# Altium project Dashboard Board.PrjPCB
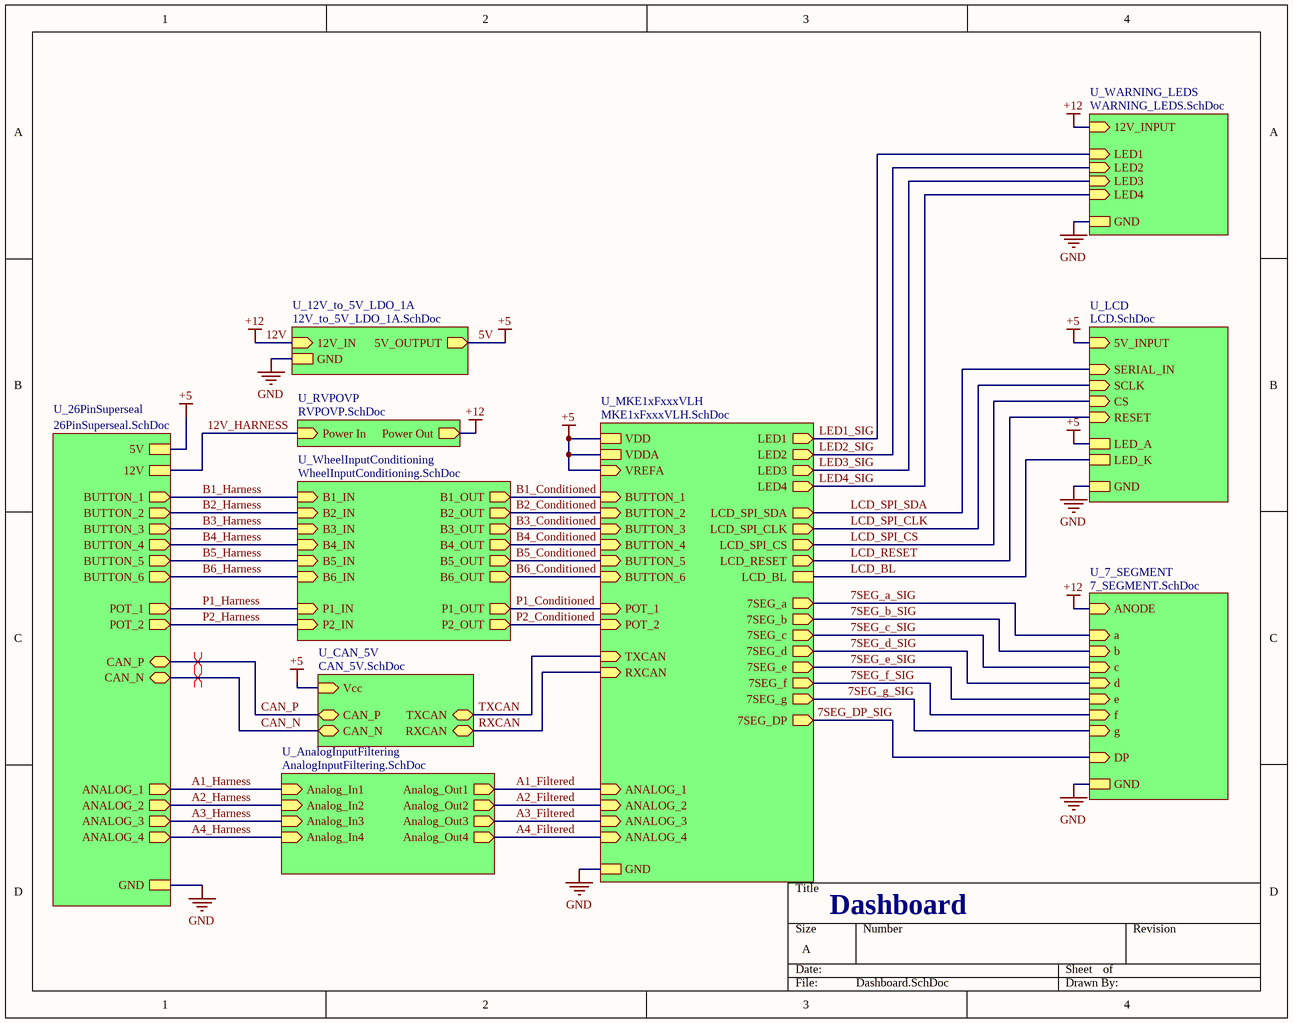
[diagram p0: Dashboard.SchDoc]
15 sheets, 126 parts. Net scope: hierarchical (ports join the sheet entries above them; power ports are global).
Board files: DashboardBoard.PcbDoc, DashboardBoardREV2.PcbDoc
Sheets:
  Dashboard.SchDoc
    U_CAN_5V = CAN_5V.SchDoc
    U_7_SEGMENT = 7_SEGMENT.SchDoc
      U_LED_Driver = LED_Driver.SchDoc
      U_LED_Driver = LED_Driver.SchDoc
      U_LED_Driver = LED_Driver.SchDoc
      U_LED_Driver = LED_Driver.SchDoc
      U_LED_Driver = LED_Driver.SchDoc
      U_LED_Driver = LED_Driver.SchDoc
      U_LED_Driver = LED_Driver.SchDoc
      U_LED_Driver = LED_Driver.SchDoc
    U_RVPOVP = RVPOVP.SchDoc
    U_WARNING_LEDS = WARNING_LEDS.SchDoc
      U_LED_Driver = LED_Driver.SchDoc
      U_LED_Driver = LED_Driver.SchDoc
      U_LED_Driver = LED_Driver.SchDoc
      U_LED_Driver = LED_Driver.SchDoc
    U_MKE1xFxxxVLH = MKE1xFxxxVLH.SchDoc
      U_FTDI_USB_UART = FTDI_USB_UART.SchDoc
    U_LCD = LCD.SchDoc
      U_LED_Driver = LED_Driver.SchDoc
    U_WheelInputConditioning = WheelInputConditioning.SchDoc
      U_ButtonBuffering = ButtonBuffering.SchDoc
      U_ButtonBuffering = ButtonBuffering.SchDoc
      U_ButtonBuffering = ButtonBuffering.SchDoc
    U_26PinSuperseal = 26PinSuperseal.SchDoc
    U_12V_to_5V_LDO_1A = 12V_to_5V_LDO_1A.SchDoc
    U_AnalogInputFiltering = AnalogInputFiltering.SchDoc
      U_PassiveFilter = PassiveFilter.SchDoc
      U_PassiveFilter = PassiveFilter.SchDoc
      U_PassiveFilter = PassiveFilter.SchDoc
      U_PassiveFilter = PassiveFilter.SchDoc

## Sheet Dashboard.SchDoc
size A; DocumentNumber: 10; SheetNumber: 10; SheetTotal: 12

### Sub-sheets
U_7_SEGMENT = 7_SEGMENT.SchDoc: GND, DP (in), ANODE (in), g (in), e (in), f (in), b (in), a (in), d (in), c (in)
U_12V_to_5V_LDO_1A = 12V_to_5V_LDO_1A.SchDoc: 12V_IN (in), GND, 5V_OUTPUT (out)
U_26PinSuperseal = 26PinSuperseal.SchDoc: GND, CAN_P (bidir), 12V, POT_2 (out), BUTTON_1 (out), BUTTON_2 (out), BUTTON_3 (out), POT_1 (out), BUTTON_4 (out), CAN_N (bidir), 5V, BUTTON_6 (out), BUTTON_5 (out), ANALOG_3 (out), ANALOG_1 (out), ANALOG_2 (out), ANALOG_4 (out)
U_AnalogInputFiltering = AnalogInputFiltering.SchDoc: Analog_In1 (in), Analog_In2 (in), Analog_In3 (in), Analog_In4 (in), Analog_Out1 (out), Analog_Out2 (out), Analog_Out3 (out), Analog_Out4 (out)
U_CAN_5V = CAN_5V.SchDoc: Vcc (in), CAN_N (bidir), CAN_P (bidir), TXCAN (bidir), RXCAN (bidir)
U_LCD = LCD.SchDoc: 5V_INPUT (in), GND, LED_A, LED_K, SCLK (in), CS (in), RESET (in), SERIAL_IN (in)
U_MKE1xFxxxVLH = MKE1xFxxxVLH.SchDoc: VDD, VDDA, VREFA (in), GND, POT_1 (in), BUTTON_4 (in), RXCAN (in), BUTTON_1 (in), BUTTON_2 (in), LED1 (out), TXCAN (in), LED4 (out), LED3 (out), LED2 (out), BUTTON_3 (in), POT_2 (in), LCD_RESET (out), LCD_SPI_CS (out), LCD_SPI_CLK (out), LCD_SPI_SDA (out), 7SEG_a (out), 7SEG_DP (out), 7SEG_e (out), 7SEG_f (out), 7SEG_d (out), 7SEG_g (out), 7SEG_c (out), 7SEG_b (out), LCD_BL, BUTTON_5 (in), BUTTON_6 (in), ANALOG_3 (in), ANALOG_1 (in), ANALOG_2 (in), ANALOG_4 (in)
U_RVPOVP = RVPOVP.SchDoc: Power Out (out), Power In (in)
U_WARNING_LEDS = WARNING_LEDS.SchDoc: GND, 12V_INPUT (in), LED1 (in), LED2 (in), LED3 (in), LED4 (in)
U_WheelInputConditioning = WheelInputConditioning.SchDoc: B1_IN (in), B2_IN (in), B3_IN (in), B4_IN (in), P1_IN (in), P2_IN (in), P2_OUT (out), P1_OUT (out), B4_OUT (out), B3_OUT (out), B2_OUT (out), B1_OUT (out), B6_IN (in), B5_OUT (out), B5_IN (in), B6_OUT (out)

### Nets
5V: sheet U_CAN_5V/Vcc, sheet U_MKE1xFxxxVLH/VDD, sheet U_MKE1xFxxxVLH/VDDA, sheet U_MKE1xFxxxVLH/VREFA, sheet U_LCD/5V_INPUT, sheet U_LCD/LED_A, sheet U_26PinSuperseal/5V, sheet U_12V_to_5V_LDO_1A/5V_OUTPUT  [also labelled +5]
12V: sheet U_7_SEGMENT/ANODE, sheet U_RVPOVP/Power Out, sheet U_WARNING_LEDS/12V_INPUT, sheet U_12V_to_5V_LDO_1A/12V_IN  [also labelled +12]
GND: sheet U_7_SEGMENT/GND, sheet U_WARNING_LEDS/GND, sheet U_MKE1xFxxxVLH/GND, sheet U_LCD/GND, sheet U_26PinSuperseal/GND, sheet U_12V_to_5V_LDO_1A/GND
7SEG_a_SIG: sheet U_7_SEGMENT/a, sheet U_MKE1xFxxxVLH/7SEG_a
7SEG_b_SIG: sheet U_7_SEGMENT/b, sheet U_MKE1xFxxxVLH/7SEG_b
7SEG_c_SIG: sheet U_7_SEGMENT/c, sheet U_MKE1xFxxxVLH/7SEG_c
7SEG_d_SIG: sheet U_7_SEGMENT/d, sheet U_MKE1xFxxxVLH/7SEG_d
7SEG_DP_SIG: sheet U_7_SEGMENT/DP, sheet U_MKE1xFxxxVLH/7SEG_DP
7SEG_e_SIG: sheet U_7_SEGMENT/e, sheet U_MKE1xFxxxVLH/7SEG_e
7SEG_f_SIG: sheet U_7_SEGMENT/f, sheet U_MKE1xFxxxVLH/7SEG_f
7SEG_g_SIG: sheet U_7_SEGMENT/g, sheet U_MKE1xFxxxVLH/7SEG_g
12V_HARNESS: sheet U_RVPOVP/Power In, sheet U_26PinSuperseal/12V
A1_Filtered: sheet U_MKE1xFxxxVLH/ANALOG_1, sheet U_AnalogInputFiltering/Analog_Out1
A1_Harness: sheet U_26PinSuperseal/ANALOG_1, sheet U_AnalogInputFiltering/Analog_In1
A2_Filtered: sheet U_MKE1xFxxxVLH/ANALOG_2, sheet U_AnalogInputFiltering/Analog_Out2
A2_Harness: sheet U_26PinSuperseal/ANALOG_2, sheet U_AnalogInputFiltering/Analog_In2
A3_Filtered: sheet U_MKE1xFxxxVLH/ANALOG_3, sheet U_AnalogInputFiltering/Analog_Out3
A3_Harness: sheet U_26PinSuperseal/ANALOG_3, sheet U_AnalogInputFiltering/Analog_In3
A4_Filtered: sheet U_MKE1xFxxxVLH/ANALOG_4, sheet U_AnalogInputFiltering/Analog_Out4
A4_Harness: sheet U_26PinSuperseal/ANALOG_4, sheet U_AnalogInputFiltering/Analog_In4
B1_Conditioned: sheet U_MKE1xFxxxVLH/BUTTON_1, sheet U_WheelInputConditioning/B1_OUT
B1_Harness: sheet U_WheelInputConditioning/B1_IN, sheet U_26PinSuperseal/BUTTON_1
B2_Conditioned: sheet U_MKE1xFxxxVLH/BUTTON_2, sheet U_WheelInputConditioning/B2_OUT
B2_Harness: sheet U_WheelInputConditioning/B2_IN, sheet U_26PinSuperseal/BUTTON_2
B3_Conditioned: sheet U_MKE1xFxxxVLH/BUTTON_3, sheet U_WheelInputConditioning/B3_OUT
B3_Harness: sheet U_WheelInputConditioning/B3_IN, sheet U_26PinSuperseal/BUTTON_3
B4_Conditioned: sheet U_MKE1xFxxxVLH/BUTTON_4, sheet U_WheelInputConditioning/B4_OUT
B4_Harness: sheet U_WheelInputConditioning/B4_IN, sheet U_26PinSuperseal/BUTTON_4
B5_Conditioned: sheet U_MKE1xFxxxVLH/BUTTON_5, sheet U_WheelInputConditioning/B5_OUT
B5_Harness: sheet U_WheelInputConditioning/B5_IN, sheet U_26PinSuperseal/BUTTON_5
B6_Conditioned: sheet U_MKE1xFxxxVLH/BUTTON_6, sheet U_WheelInputConditioning/B6_OUT
B6_Harness: sheet U_WheelInputConditioning/B6_IN, sheet U_26PinSuperseal/BUTTON_6
CAN_N: sheet U_CAN_5V/CAN_N, sheet U_26PinSuperseal/CAN_N
CAN_P: sheet U_CAN_5V/CAN_P, sheet U_26PinSuperseal/CAN_P
LCD_BL: sheet U_MKE1xFxxxVLH/LCD_BL, sheet U_LCD/LED_K
LCD_RESET: sheet U_MKE1xFxxxVLH/LCD_RESET, sheet U_LCD/RESET
LCD_SPI_CLK: sheet U_MKE1xFxxxVLH/LCD_SPI_CLK, sheet U_LCD/SCLK
LCD_SPI_CS: sheet U_MKE1xFxxxVLH/LCD_SPI_CS, sheet U_LCD/CS
LCD_SPI_SDA: sheet U_MKE1xFxxxVLH/LCD_SPI_SDA, sheet U_LCD/SERIAL_IN
LED1_SIG: sheet U_WARNING_LEDS/LED1, sheet U_MKE1xFxxxVLH/LED1  [project net LED1]
LED2_SIG: sheet U_WARNING_LEDS/LED2, sheet U_MKE1xFxxxVLH/LED2  [project net LED2]
LED3_SIG: sheet U_WARNING_LEDS/LED3, sheet U_MKE1xFxxxVLH/LED3  [project net LED3]
LED4_SIG: sheet U_WARNING_LEDS/LED4, sheet U_MKE1xFxxxVLH/LED4  [project net LED4]
P1_Conditioned: sheet U_MKE1xFxxxVLH/POT_1, sheet U_WheelInputConditioning/P1_OUT
P1_Harness: sheet U_WheelInputConditioning/P1_IN, sheet U_26PinSuperseal/POT_1
P2_Conditioned: sheet U_MKE1xFxxxVLH/POT_2, sheet U_WheelInputConditioning/P2_OUT
P2_Harness: sheet U_WheelInputConditioning/P2_IN, sheet U_26PinSuperseal/POT_2
RXCAN: sheet U_CAN_5V/RXCAN, sheet U_MKE1xFxxxVLH/RXCAN
TXCAN: sheet U_CAN_5V/TXCAN, sheet U_MKE1xFxxxVLH/TXCAN

### Layout directives
differential pair: CAN_N, CAN_P

### Notes on the sheet
- Dashboard

## Sheet CAN_5V.SchDoc
size A; DocumentNumber: 5; SheetNumber: 5; SheetTotal: 12
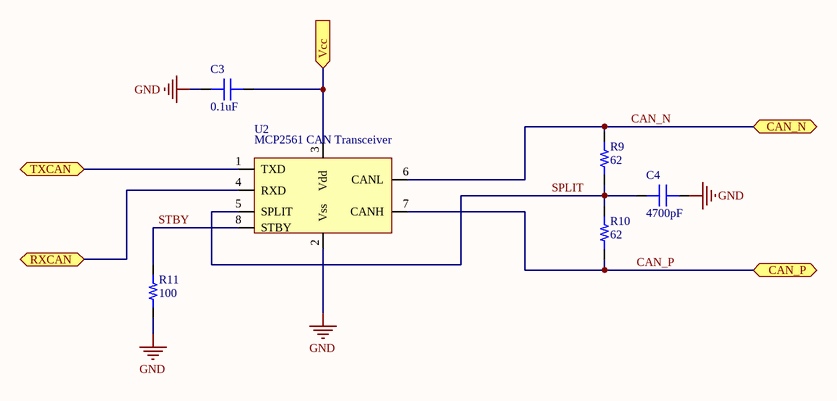
[diagram p1: CAN_5V.SchDoc]

### Parts
(Parts that share a designator on the sheet are numbered #1, #2 ... from top to bottom, then left to right.)
C3#1  capacitance: 0.1uF  [0603]  (hidden comment: capacitor)
C4#1  capacitance: 4700pF  [0603]  (hidden comment: capacitor)
R9  62  [RES 0603/1608]
R10  62  [RES 0603/1608]
R11  100  [RES 0603/1608]
U2  MCP2561 CAN Transceiver  [SOIC-8]

### Ports
CAN_N (bidir), CAN_P (bidir), RXCAN (bidir), TXCAN (bidir), Vcc (in)

### Nets
5V: C3#1.2 U2.3(Vdd) ; port Vcc
GND: C3#1.1 C4#1.2 R11.1 U2.2(Vss)
CAN_N: R9.2 U2.6(CANL) ; port CAN_N
CAN_P: R10.1 U2.7(CANH) ; port CAN_P
RXCAN: U2.4(RXD) ; port RXCAN
SPLIT: C4#1.1 R9.1 R10.2 U2.5(SPLIT)
STBY: R11.2 U2.8(STBY)
TXCAN: U2.1(TXD) ; port TXCAN

### Library data of the parts
C3#1 C4#1 = 1: Generic 0603 capacitor; id: 1; voltage: 50; dielectric: Ceramic; percent tolerance: 10; name: 0603 Capacitor; ESR: 1; package: 0603; quantity: 0
R9-R11 = 1: id: 1; name: 0603 Resistor; percent tolerance: 5; package: 0603; quantity: 0
  R9 R10: resistance: 62
  R11: resistance: 100
U2 = 5: id: 5; name: null; vcc: 0; type: CAN; package: SOIC-8; quantity: 0; link: https://www.digikey.com/product-detail/en/microchip-technology/MCP2561T-E-SN/MCP2561T-E-SNCT-ND/5148846

## Sheet 7_SEGMENT.SchDoc
size A; DocumentNumber: 6; SheetNumber: 6; SheetTotal: 12
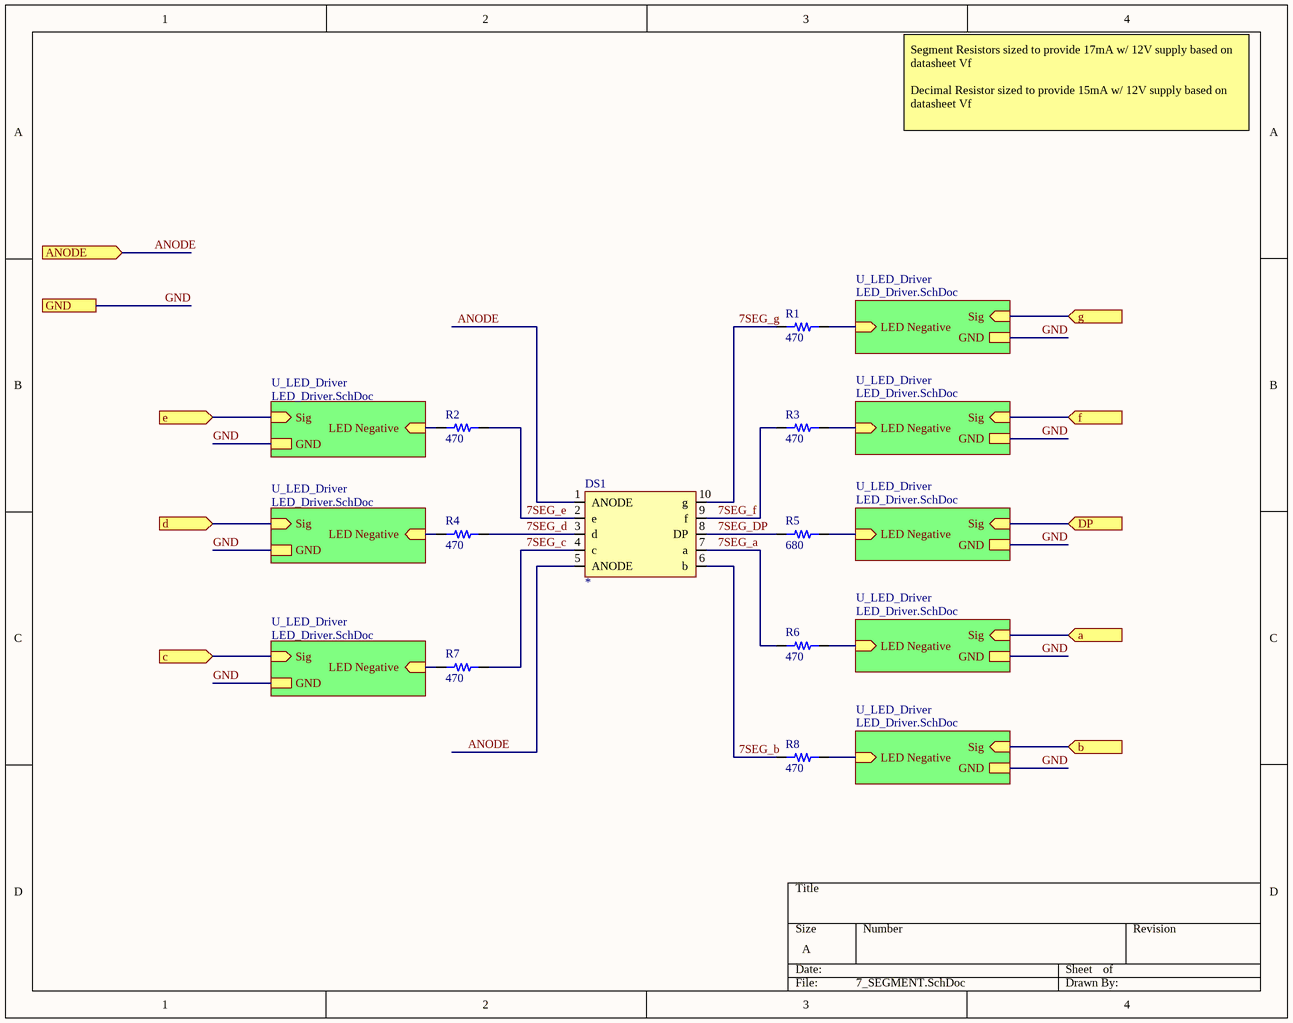
[diagram p2: 7_SEGMENT.SchDoc]

### Parts
(Parts that share a designator on the sheet are numbered #1, #2 ... from top to bottom, then left to right.)
DS1  *  [SA15-11EWA]
R1#1  470  [RES 0805/2012]
R2#1  470  [RES 0805/2012]
R3#1  470  [RES 0805/2012]
R4#1  470  [RES 0805/2012]
R5#1  680  [RES 0805/2012]
R6#1  470  [RES 0805/2012]
R7#1  470  [RES 0805/2012]
R8#1  470  [RES 0805/2012]

### Sub-sheets
U_LED_Driver = LED_Driver.SchDoc: LED Negative (in), Sig (in), GND
U_LED_Driver = LED_Driver.SchDoc: LED Negative (in), Sig (in), GND
U_LED_Driver = LED_Driver.SchDoc: LED Negative (in), Sig (in), GND
U_LED_Driver = LED_Driver.SchDoc: LED Negative (in), Sig (in), GND
U_LED_Driver = LED_Driver.SchDoc: LED Negative (in), Sig (in), GND
U_LED_Driver = LED_Driver.SchDoc: LED Negative (in), Sig (in), GND
U_LED_Driver = LED_Driver.SchDoc: LED Negative (in), Sig (in), GND
U_LED_Driver = LED_Driver.SchDoc: LED Negative (in), Sig (in), GND

### Ports
a (in), ANODE (in), b (in), c (in), d (in), DP (in), e (in), f (in), g (in), GND

### Nets
ANODE: DS1.1(ANODE) DS1.5(ANODE) ; port ANODE  [project net 12V]
GND: port GND, sheet U_LED_Driver/GND, sheet U_LED_Driver/GND, sheet U_LED_Driver/GND, sheet U_LED_Driver/GND, sheet U_LED_Driver/GND, sheet U_LED_Driver/GND, sheet U_LED_Driver/GND, sheet U_LED_Driver/GND
7SEG_a: DS1.7(a) R6#1.1
7SEG_a_SIG: port a, sheet U_LED_Driver/Sig
7SEG_b: DS1.6(b) R8#1.1
7SEG_b_SIG: port b, sheet U_LED_Driver/Sig
7SEG_c: DS1.4(c) R7#1.2
7SEG_c_SIG: port c, sheet U_LED_Driver/Sig
7SEG_d: DS1.3(d) R4#1.2
7SEG_d_SIG: port d, sheet U_LED_Driver/Sig
7SEG_DP: DS1.8(DP) R5#1.1
7SEG_DP_SIG: port DP, sheet U_LED_Driver/Sig
7SEG_e: DS1.2(e) R2#1.2
7SEG_e_SIG: port e, sheet U_LED_Driver/Sig
7SEG_f: DS1.9(f) R3#1.1
7SEG_f_SIG: port f, sheet U_LED_Driver/Sig
7SEG_g: DS1.10(g) R1#1.1
7SEG_g_SIG: port g, sheet U_LED_Driver/Sig
LED_Negative: R1#1.2 ; sheet U_LED_Driver/LED Negative
LED_Negative: R5#1.2 ; sheet U_LED_Driver/LED Negative  [a separate net that carries the same name]
LED_Negative: R3#1.2 ; sheet U_LED_Driver/LED Negative  [a separate net that carries the same name]
LED_Negative: R6#1.2 ; sheet U_LED_Driver/LED Negative  [a separate net that carries the same name]
LED_Negative: R8#1.2 ; sheet U_LED_Driver/LED Negative  [a separate net that carries the same name]
LED_Negative: R7#1.1 ; sheet U_LED_Driver/LED Negative  [a separate net that carries the same name]
LED_Negative: R4#1.1 ; sheet U_LED_Driver/LED Negative  [a separate net that carries the same name]
LED_Negative: R2#1.1 ; sheet U_LED_Driver/LED Negative  [a separate net that carries the same name]

### Notes on the sheet
- Segment Resistors sized to provide 17mA w/ 12V supply based on datasheet Vf
  Decimal Resistor sized to provide 15mA w/ 12V supply based on datasheet Vf

### Library data of the parts
DS1 = 40: 7SEG DISPLAY 1DIGIT RED 1.5" CA; id: 40; vcc: 4; voltageinmax: 5; MfrPartNo: *; name: SA15-11EWA; quantity: 0; link: https://www.digikey.com/short/pdvmpz; createdby: Kevin
R1#1 R2#1 R3#1 R4#1 R5#1 R6#1 R7#1 R8#1 = 2: id: 2; name: 0805 Resistor; percent tolerance: 5; power: 1/4; package: 0805; quantity: 0; createdby: Kevin
  R1-R4 R6-R8: resistance: 470
  R5: resistance: 680

## Sheet LED_Driver.SchDoc
size A; DocumentNumber: 9; SheetNumber: 9; SheetTotal: 12
Used 13 times, as channels U_7_SEGMENT/U_LED_Driver, U_7_SEGMENT/U_LED_Driver, U_7_SEGMENT/U_LED_Driver, U_7_SEGMENT/U_LED_Driver, U_7_SEGMENT/U_LED_Driver, U_7_SEGMENT/U_LED_Driver, U_7_SEGMENT/U_LED_Driver, U_7_SEGMENT/U_LED_Driver, U_WARNING_LEDS/U_LED_Driver, U_WARNING_LEDS/U_LED_Driver, U_WARNING_LEDS/U_LED_Driver, U_WARNING_LEDS/U_LED_Driver, U_LCD/U_LED_Driver. Parts and nets are listed once, with the designators drawn on the sheet.
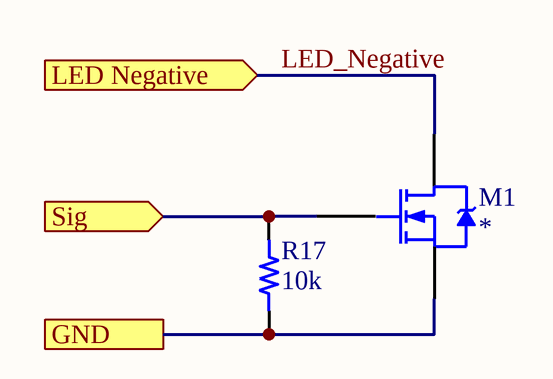
[diagram p3: LED_Driver.SchDoc]

### Parts
M1  *  [SOT23-3]
R17  10k  [RES 0603/1608]

### Ports
GND, LED Negative (in), Sig (in)

### Nets
GND: M1.2(S) R17.1 ; port GND
LED_Negative: M1.3(D) ; port LED Negative
Sig: M1.1(G) R17.2 ; port Sig

### Channels
U_7_SEGMENT/U_LED_Driver: designators M1=M7 R17=R43; ports GND=GND LED Negative=LED_Negative Sig=7SEG_g_SIG
U_7_SEGMENT/U_LED_Driver: designators M1=M6 R17=R42; ports GND=GND LED Negative=LED_Negative Sig=7SEG_f_SIG
U_7_SEGMENT/U_LED_Driver: designators M1=M5 R17=R41; ports GND=GND LED Negative=LED_Negative Sig=7SEG_DP_SIG
U_7_SEGMENT/U_LED_Driver: designators M1=M8 R17=R44; ports GND=GND LED Negative=LED_Negative Sig=7SEG_a_SIG
U_7_SEGMENT/U_LED_Driver: designators M1=M11 R17=R47; ports GND=GND LED Negative=LED_Negative Sig=7SEG_b_SIG
U_7_SEGMENT/U_LED_Driver: designators M1=M10 R17=R46; ports GND=GND LED Negative=LED_Negative Sig=7SEG_e_SIG
U_7_SEGMENT/U_LED_Driver: designators M1=M9 R17=R45; ports GND=GND LED Negative=LED_Negative Sig=7SEG_d_SIG
U_7_SEGMENT/U_LED_Driver: designators M1=M12 R17=R48; ports GND=GND LED Negative=LED_Negative Sig=7SEG_c_SIG
U_WARNING_LEDS/U_LED_Driver: designators M1=M3 R17=R16#1; ports GND=GND LED Negative=LED_Negative Sig=LED1
U_WARNING_LEDS/U_LED_Driver: designators M1=M4 R17=R15#1; ports GND=GND LED Negative=LED_Negative Sig=LED2
U_WARNING_LEDS/U_LED_Driver: designators M1=M1 R17=R13#1; ports GND=GND LED Negative=LED_Negative Sig=LED3
U_WARNING_LEDS/U_LED_Driver: designators M1=M2 R17=R14#1; ports GND=GND LED Negative=LED_Negative Sig=LED4
U_LCD/U_LED_Driver: designators M1=M13 R17=R50; ports GND=GND LED Negative=LED_Negative Sig=LCD_BL

### Library data of the parts
M1 = 6: MOSFET N-CHANNEL 30V 5A SOT23; id: 6; vdsmax: 0; numcircuits: 1; current: 2.8A; rdson: 90mOhm; vt: 800; MfrPartNo: *; name: DMG2302UK-7; type: N_Channel; vgsmax: 1; package: SOT-23; quantity: 0; link: https://www.digikey.com/product-detail/en/diodes-incorporated/DMG2302UK-7/DMG2302UK-7DICT-ND/6010163
R17 = 1: as R9 on sheet CAN_5V; resistance: 10k; package: 0603; quantity: 0

## Sheet RVPOVP.SchDoc
size A; DocumentNumber: 4; SheetNumber: 4; SheetTotal: 12
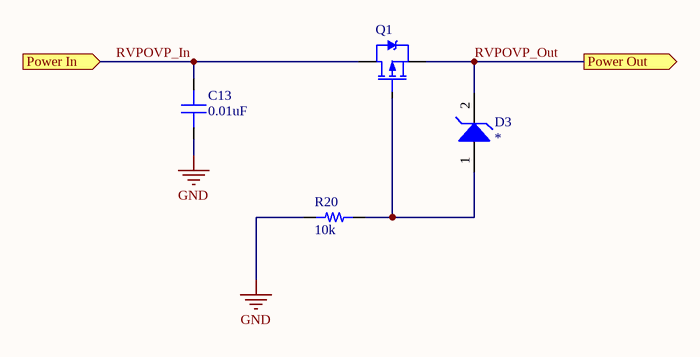
[diagram p4: RVPOVP.SchDoc]

### Parts
(Parts that share a designator on the sheet are numbered #1, #2 ... from top to bottom, then left to right.)
C13#1  capacitance: 0.01uF  [0603]  (hidden comment: capacitor)
D3  *  [SOD123F]
Q1  DMP3010LK3-13  [DMP3010LK3-13]  (value not drawn)
R20  10k  [RES 0603/1608]

### Ports
Power In (in), Power Out (out)

### Nets
GND: C13#1.1 R20.1
RVPOVP_Out: D3.2(K) Q1.2(S) ; port Power Out  [project net 12V]
RVPOVP_In: C13#1.2 Q1.3(D) ; port Power In  [project net 12V_HARNESS]
NetD3_1: D3.1(A) Q1.1(G) R20.2

### Library data of the parts
C13#1 = 1: as C3#1 on sheet CAN_5V; name: 0603 Capacitor; ESR: 1; package: 0603; quantity: 0
D3 = 10: Zener Diode 14V 500mW ±5% Surface Mount SOD-1; id: 10; name: DDZ9701; MfrPartNo: *; package: SOD-123; quantity: 0; link: https://www.digikey.com/product-detail/en/diodes-incorporated/DDZ9701-7/DDZ9701-7DICT-ND/3877402
Q1 = 26: P-Channel MOSFET 30V 17A TO252; Manufacturer_id: 1; idFuse: 3; id: 26; type: P_Channel; vdsmax: 30; rdson: 8mOhm; vgsmax: 20; Drawer_id: 1; Name: DMP3010LK3-13; numcircuits: 1; current: 17A; package: TO-252-3; quantity: 0; link: https://www.digikey.com/product-detail/en/diodes-incorporated/DMP3010LK3-13/DMP3010LK3-13DICT-ND/3076574; createdby: Kevin
R20 = 1: as R9 on sheet CAN_5V; resistance: 10k; package: 0603; quantity: 0

## Sheet WARNING_LEDS.SchDoc
size A; DocumentNumber: 8; SheetNumber: 8; SheetTotal: 12
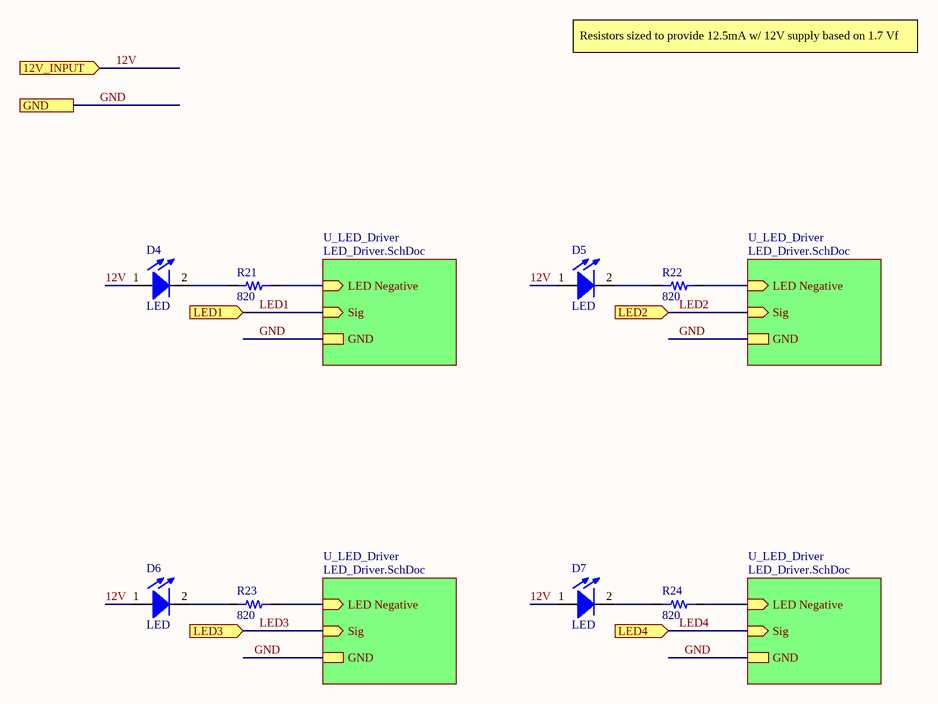
[diagram p5: WARNING_LEDS.SchDoc]

### Parts
(Parts that share a designator on the sheet are numbered #1, #2 ... from top to bottom, then left to right.)
D4  LED  [LED TH]
D5  LED  [LED TH]
D6#1  LED  [LED TH]
D7#1  LED  [LED TH]
R21  820  [RES 0805/2012]
R22  820  [RES 0805/2012]
R23  820  [RES 0805/2012]
R24  820  [RES 0805/2012]

### Sub-sheets
U_LED_Driver = LED_Driver.SchDoc: Sig (in), GND, LED Negative (in)
U_LED_Driver = LED_Driver.SchDoc: Sig (in), GND, LED Negative (in)
U_LED_Driver = LED_Driver.SchDoc: Sig (in), GND, LED Negative (in)
U_LED_Driver = LED_Driver.SchDoc: Sig (in), GND, LED Negative (in)

### Ports
12V_INPUT (in), GND, LED1 (in), LED2 (in), LED3 (in), LED4 (in)

### Nets
12V: D4.1(A) D5.1(A) D6#1.1(A) D7#1.1(A) ; port 12V_INPUT
GND: port GND, sheet U_LED_Driver/GND, sheet U_LED_Driver/GND, sheet U_LED_Driver/GND, sheet U_LED_Driver/GND
LED1: port LED1, sheet U_LED_Driver/Sig
LED2: port LED2, sheet U_LED_Driver/Sig
LED3: port LED3, sheet U_LED_Driver/Sig
LED4: port LED4, sheet U_LED_Driver/Sig
LED_Negative: R21.2 ; sheet U_LED_Driver/LED Negative
LED_Negative: R23.2 ; sheet U_LED_Driver/LED Negative  [a separate net that carries the same name]
LED_Negative: R24.2 ; sheet U_LED_Driver/LED Negative  [a separate net that carries the same name]
LED_Negative: R22.2 ; sheet U_LED_Driver/LED Negative  [a separate net that carries the same name]
NetD4_2: D4.2(K) R21.1
NetD5_2: D5.2(K) R22.1
NetD6#1_2: D6#1.2(K) R23.1
NetD7#1_2: D7#1.2(K) R24.1

### Notes on the sheet
- Resistors sized to provide 12.5mA w/ 12V supply based on 1.7 Vf

### Library data of the parts
D4 D5 D6#1 D7#1 = 23: Thru Hole LED; id: 23; vr: 2.59999990463257; numcircuits: 1; updatedby: Andrew; name: LED; quantity: 1; createdby: Andrew; createddate: 10/16/2019 10:17:38 PM; updateddate: 10/16/2019 10:17:38 PM
R21-R24 = 2: as R1#1 on sheet 7_SEGMENT; resistance: 820; package: 0805; quantity: 0; createdby: Kevin

## Sheet MKE1xFxxxVLH.SchDoc
size A; DocumentNumber: 2; SheetNumber: 2; SheetTotal: 12
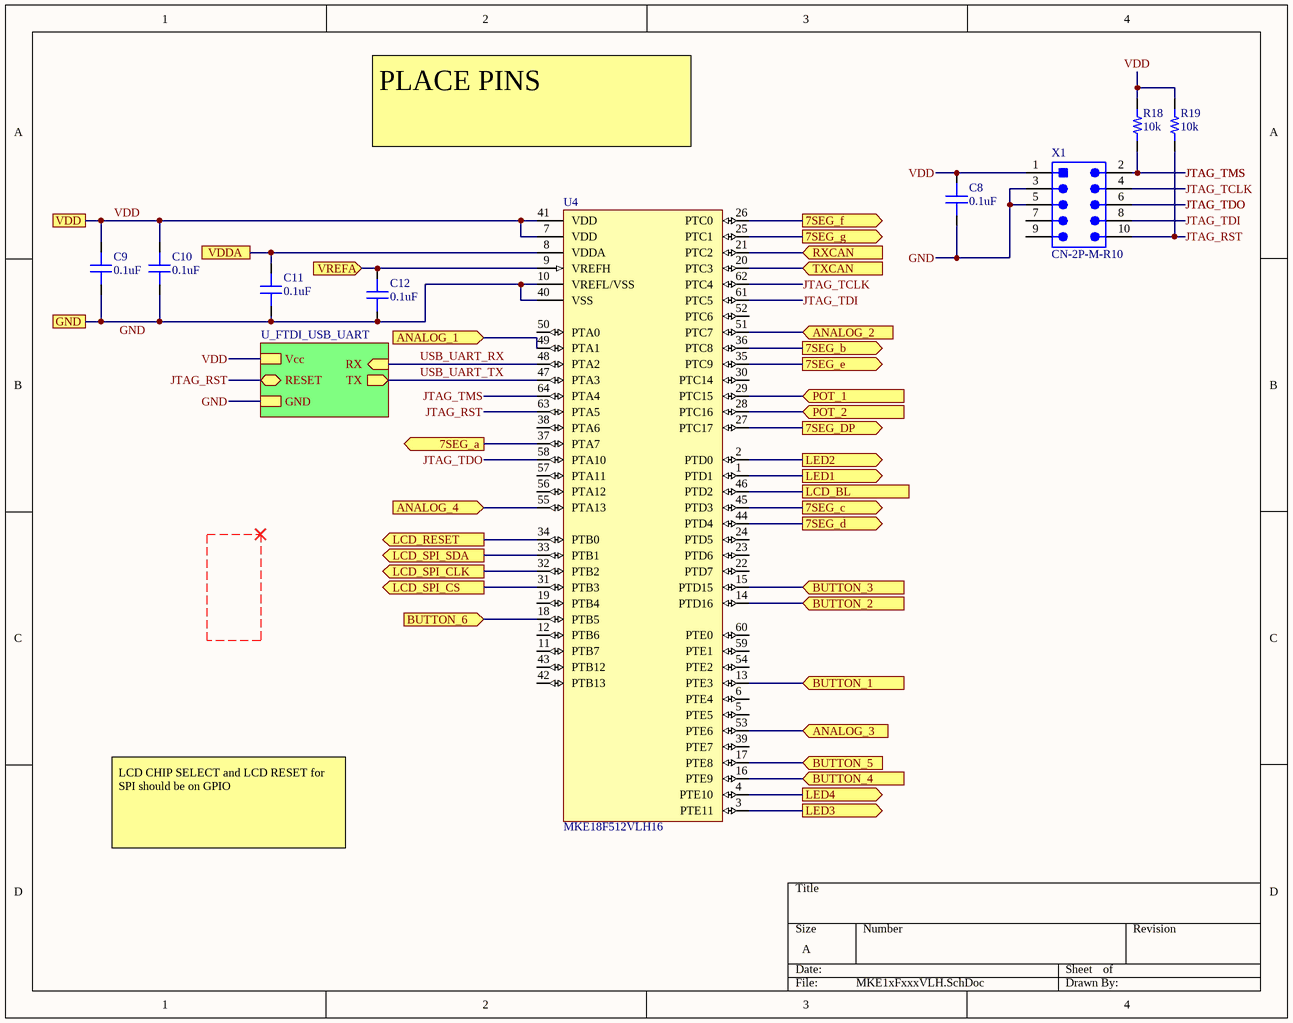
[diagram p6: MKE1xFxxxVLH.SchDoc]

### Parts
(Parts that share a designator on the sheet are numbered #1, #2 ... from top to bottom, then left to right.)
C8#1  capacitance: 0.1uF  [0603]  (hidden comment: capacitor)
C9#1  capacitance: 0.1uF  [0603]  (hidden comment: capacitor)
C10#1  capacitance: 0.1uF  [0603]  (hidden comment: capacitor)
C11  capacitance: 0.1uF  [0603]  (hidden comment: capacitor)
C12#1  capacitance: 0.1uF  [0603]  (hidden comment: capacitor)
R18  10k  [RES 0603/1608]
R19  10k  [RES 0603/1608]
U4  MKE18F512VLH16  [TQFP64]
X1  CN-2P-M-R10  [HDR2X5_SMT]

### Sub-sheets
U_FTDI_USB_UART = FTDI_USB_UART.SchDoc: Vcc, GND, RESET (bidir), TX (out), RX (in)

### Ports
7SEG_a (out), 7SEG_b (out), 7SEG_c (out), 7SEG_d (out), 7SEG_DP (out), 7SEG_e (out), 7SEG_f (out), 7SEG_g (out), ANALOG_1 (in), ANALOG_2 (in), ANALOG_3 (in), ANALOG_4 (in), BUTTON_1 (in), BUTTON_2 (in), BUTTON_3 (in), BUTTON_4 (in), BUTTON_5 (in), BUTTON_6 (in), GND, LCD_BL, LCD_RESET (out), LCD_SPI_CLK (out), LCD_SPI_CS (out), LCD_SPI_SDA (out), LED1 (out), LED2 (out), LED3 (out), LED4 (out), POT_1 (in), POT_2 (in), RXCAN (in), TXCAN (in), VDD, VDDA, VREFA (in)

### Nets
GND: C8#1.1 C9#1.1 C10#1.1 C11.1 C12#1.1 U4.10(VREFL/VSS) U4.40(VSS) X1.3 X1.5 ; port GND, sheet U_FTDI_USB_UART/GND
VDD: C8#1.2 C9#1.2 C10#1.2 C11.2 C12#1.2 R18.2 R19.2 U4.7(VDD) U4.8(VDDA) U4.9(VREFH) U4.41(VDD) X1.1 ; port VDD, port VDDA, port VREFA, sheet U_FTDI_USB_UART/Vcc  [project net 5V]
7SEG_a_SIG: U4.37(PTA7) ; port 7SEG_a
7SEG_b_SIG: U4.36(PTC8) ; port 7SEG_b
7SEG_c_SIG: U4.45(PTD3) ; port 7SEG_c
7SEG_d_SIG: U4.44(PTD4) ; port 7SEG_d
7SEG_DP_SIG: U4.27(PTC17) ; port 7SEG_DP
7SEG_e_SIG: U4.35(PTC9) ; port 7SEG_e
7SEG_f_SIG: U4.26(PTC0) ; port 7SEG_f
7SEG_g_SIG: U4.25(PTC1) ; port 7SEG_g
A1_Filtered: U4.49(PTA1) ; port ANALOG_1
A2_Filtered: U4.51(PTC7) ; port ANALOG_2
A3_Filtered: U4.53(PTE6) ; port ANALOG_3
A4_Filtered: U4.55(PTA13) ; port ANALOG_4
B1_Conditioned: U4.13(PTE3) ; port BUTTON_1
B2_Conditioned: U4.14(PTD16) ; port BUTTON_2
B3_Conditioned: U4.15(PTD15) ; port BUTTON_3
B4_Conditioned: U4.16(PTE9) ; port BUTTON_4
B5_Conditioned: U4.17(PTE8) ; port BUTTON_5
B6_Conditioned: U4.18(PTB5) ; port BUTTON_6
JTAG_RST: R19.1 U4.63(PTA5) X1.10 ; sheet U_FTDI_USB_UART/RESET
JTAG_TCLK: U4.62(PTC4) X1.4
JTAG_TDI: U4.61(PTC5) X1.8
JTAG_TDO: U4.58(PTA10) X1.6
JTAG_TMS: R18.1 U4.64(PTA4) X1.2
LCD_BL: U4.46(PTD2) ; port LCD_BL
LCD_RESET: U4.34(PTB0) ; port LCD_RESET
LCD_SPI_CLK: U4.32(PTB2) ; port LCD_SPI_CLK
LCD_SPI_CS: U4.31(PTB3) ; port LCD_SPI_CS
LCD_SPI_SDA: U4.33(PTB1) ; port LCD_SPI_SDA
LED1: U4.1(PTD1) ; port LED1
LED2: U4.2(PTD0) ; port LED2
LED3: U4.3(PTE11) ; port LED3
LED4: U4.4(PTE10) ; port LED4
P1_Conditioned: U4.29(PTC15) ; port POT_1
P2_Conditioned: U4.28(PTC16) ; port POT_2
RXCAN: U4.21(PTC2) ; port RXCAN
TXCAN: U4.20(PTC3) ; port TXCAN
USB_UART_RX: U4.48(PTA2) ; sheet U_FTDI_USB_UART/RX
USB_UART_TX: U4.47(PTA3) ; sheet U_FTDI_USB_UART/TX

Not connected (* = marked no-connect by the designer): U4 5(PTE5) 6(PTE4) 11(PTB7) 12(PTB6) 19(PTB4) 22(PTD7) 23(PTD6) 24(PTD5) 30(PTC14) 38(PTA6) 39(PTE7) 42(PTB13) 43(PTB12) 50(PTA0) 52(PTC6) 54(PTE2) 56(PTA12) 57(PTA11) 59(PTE1) 60(PTE0); X1 7 9

### Notes on the sheet
- PLACE PINS
- LCD CHIP SELECT and LCD RESET for SPI should be on GPIO

### Library data of the parts
C8#1 C9#1 C10#1 C11 C12#1 = 1: as C3#1 on sheet CAN_5V; Name: 0603 Capacitor; ESR: 1; package: 0603; quantity: 0
R18 R19 = 1: as R9 on sheet CAN_5V; resistance: 10k; package: 0603; quantity: 0
U4 = 1: 32b NXP Microcontroller; id: 1; voltagemin: 2.70000004768372; voltagemax: 5.5; name: MKE18F512VLH16; package: TQFP64; quantity: 0
X1 = 4: CONN_TE_2X5POS; id: 4; Name: 5103309-1; numcontacts: 10; numrows: 2; pitch: 2.54mm; MfrPartNo: *; link: https://www.digikey.com/product-detail/en/5103309-1/A33160-ND/1114898?utm_campaign=buynow&WT.z_cid=ref_octopart_dkc_buynow&utm_medium=aggregator&curr=usd&site=us&utm_source=octopart; quantity: 0

## Sheet FTDI_USB_UART.SchDoc
size A; DocumentNumber: 1; SheetNumber: 1; SheetTotal: 12
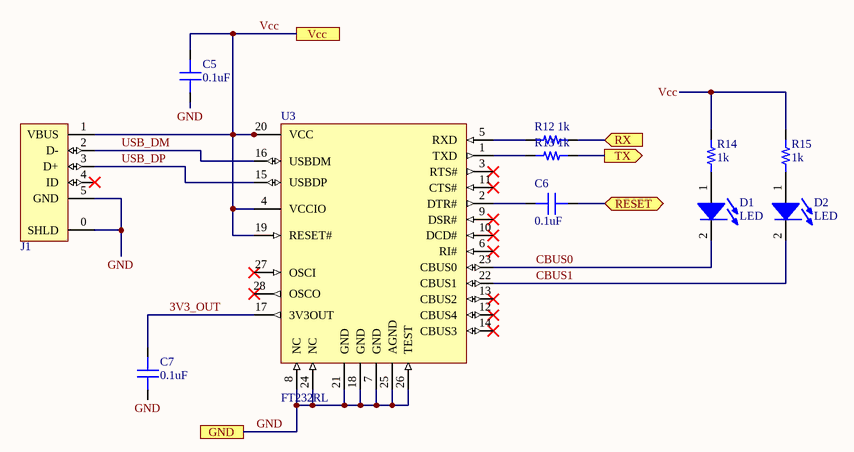
[diagram p7: FTDI_USB_UART.SchDoc]

### Parts
(Parts that share a designator on the sheet are numbered #1, #2 ... from top to bottom, then left to right.)
C5#1  capacitance: 0.1uF  [0603]  (hidden comment: capacitor)
C6#1  capacitance: 0.1uF  [0603]  (hidden comment: capacitor)
C7#1  capacitance: 0.1uF  [0603]  (hidden comment: capacitor)
D1  LED  [0805_LED]
D2  LED  [0805_LED]
J1  USB Micro  [ZX62WRD-B-5PC]  (value not drawn)
R12  1k  [RES 0603/1608]
R13#2  1k  [RES 0603/1608]
R14#2  1k  [RES 0603/1608]
R15#2  1k  [RES 0603/1608]
U3  FT232RL  [SSOP-28]

### Ports
GND, RESET (bidir), RX (in), TX (out), Vcc

### Nets
GND: C5#1.1 C7#1.1 J1.0(SHLD) J1.5(GND) U3.7(GND) U3.8(NC) U3.18(GND) U3.21(GND) U3.24(NC) U3.25(AGND) U3.26(TEST) ; port GND
Vcc: C5#1.2 J1.1(VBUS) R14#2.2 R15#2.2 U3.4(VCCIO) U3.19(RESET#) U3.20(VCC) ; port Vcc  [project net 5V]
3V3_OUT: C7#1.2 U3.17(3V3OUT)
CBUS0: D1.2(K) U3.23(CBUS0)
CBUS1: D2.2(K) U3.22(CBUS1)
JTAG_RST: C6#1.1 ; port RESET
USB_DM: J1.2(D-) U3.16(USBDM)
USB_DP: J1.3(D+) U3.15(USBDP)
USB_UART_RX: R12.2 ; port RX
USB_UART_TX: R13#2.2 ; port TX
NetC6#1_2: C6#1.2 U3.2(DTR#)
NetD1_1: D1.1(A) R14#2.1
NetD2_1: D2.1(A) R15#2.1
NetR12_1: R12.1 U3.5(RXD)
NetR13#2_1: R13#2.1 U3.1(TXD)

Not connected (* = marked no-connect by the designer): J1 4(ID)*; U3 3(RTS#)* 6(RI#)* 9(DSR#)* 10(DCD#)* 11(CTS#)* 12(CBUS4)* 13(CBUS2)* 14(CBUS3)* 27(OSCI)* 28(OSCO)*

### Library data of the parts
C5#1 C6#1 C7#1 = 1: Generic 0603 capacitor; id: 1
D1 D2 = 19: Generic 0805 LED; id: 19
J1 = 29: Micro USB; id: 29
R12 R13#2 R14#2 R15#2 = 1: as R9 on sheet CAN_5V; resistance: 1k; package: 0603; quantity: 0
U3 = 3: id: 3; name: null; vcc: 0; type: UART; quantity: 0; link: https://www.digikey.com/product-detail/en/ftdi-future-technology-devices-international-ltd/FT232RL-REEL/768-1007-1-ND/1836402

## Sheet LCD.SchDoc
size A; DocumentNumber: 7; SheetNumber: 7; SheetTotal: 12
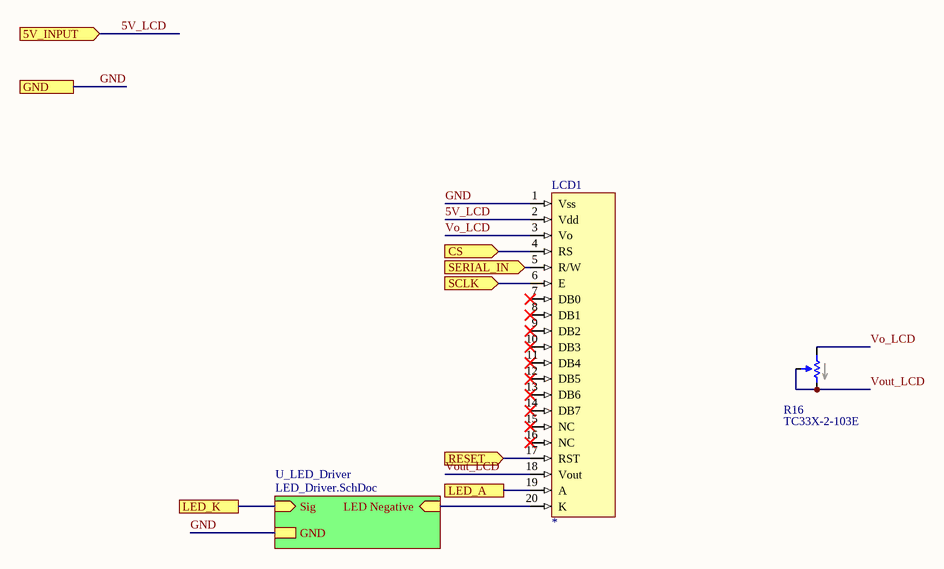
[diagram p8: LCD.SchDoc]

### Parts
(Parts that share a designator on the sheet are numbered #1, #2 ... from top to bottom, then left to right.)
LCD1  *  [CFAG12864S]
R16#2  TC33X-2-103E  [35WR]

### Sub-sheets
U_LED_Driver = LED_Driver.SchDoc: LED Negative (in), Sig (in), GND

### Ports
5V_INPUT (in), CS (in), GND, LED_A, LED_K, RESET (in), SCLK (in), SERIAL_IN (in)

### Nets
5V_LCD: LCD1.2(Vdd) LCD1.19(A) ; port 5V_INPUT, port LED_A  [project net 5V]
GND: LCD1.1(Vss) ; port GND, sheet U_LED_Driver/GND
LCD_BL: port LED_K, sheet U_LED_Driver/Sig
LCD_RESET: LCD1.17(RST) ; port RESET
LCD_SPI_CLK: LCD1.6(E) ; port SCLK
LCD_SPI_CS: LCD1.4(RS) ; port CS
LCD_SPI_SDA: LCD1.5(R/W) ; port SERIAL_IN
LED_Negative: LCD1.20(K) ; sheet U_LED_Driver/LED Negative
Vo_LCD: LCD1.3(Vo) R16#2.1
Vout_LCD: LCD1.18(Vout) R16#2.2 R16#2.3

Not connected (* = marked no-connect by the designer): LCD1 7(DB0)* 8(DB1)* 9(DB2)* 10(DB3)* 11(DB4)* 12(DB5)* 13(DB6)* 14(DB7)* 15(NC)* 16(NC)*

### Library data of the parts
LCD1 = 41: Sunlight Readable 128x64 SPI or Parallel Graphic LCD; id: 41; vcc: 5; voltageinmax: 5.5; MfrPartNo: *; name: CFAG12864S; quantity: 0; link: https://www.crystalfontz.com/product/cfag12864syyhvt-lcd-graphical-128x64; createdby: Kevin
R16#2 = 1: TRIMMER 10K OHM 0.1W J LEAD TOP; MF: Bourns; id: 1; resistance: 10; voltage: 50; numcontacts: 3; numrows: 0; Digi-Key_Part_Number: TC33X-103ECT-ND; SnapEDA_Link: https://www.snapeda.com/parts/TC33X-2-103E/Bourns/view-part/?ref=snap; MP: TC33X-2-103E; Package: SOD-23 Bourns; Digi-Key_Purchase_URL: https://www.digikey.com/product-detail/en/bourns-inc/TC33X-2-103E/TC33X-103ECT-ND/612911?utm_source=snapeda&utm_medium=aggregator&utm_campaign=symbol; Value: *; Name: TC33X-2-103E; pitch: 0; quantity: 0; link: https://www.digikey.com/product-detail/en/bourns-inc/TC33X-2-103E/TC33X-103ECT-ND/612911; createdby: Kevin; createddate: 10/15/2019

## Sheet WheelInputConditioning.SchDoc
size A; DocumentNumber: 12; SheetNumber: 12; SheetTotal: 12
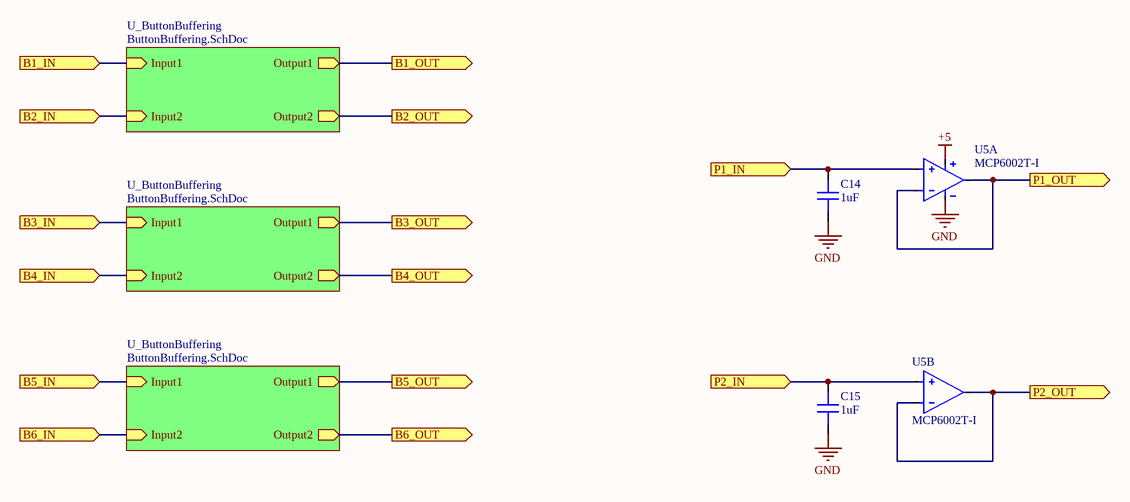
[diagram p9: WheelInputConditioning.SchDoc]

### Parts
(Parts that share a designator on the sheet are numbered #1, #2 ... from top to bottom, then left to right.)
C14#1  capacitance: 1uF  [0603]  (hidden comment: capacitor)
C15#1  capacitance: 1uF  [0603]  (hidden comment: capacitor)
U5#1  MCP6002T-I  [SOIC-8]  (parts A,B of 2)

### Sub-sheets
U_ButtonBuffering = ButtonBuffering.SchDoc: Input2 (in), Output1 (out), Output2 (out), Input1 (in)
U_ButtonBuffering = ButtonBuffering.SchDoc: Input2 (in), Output1 (out), Output2 (out), Input1 (in)
U_ButtonBuffering = ButtonBuffering.SchDoc: Input2 (in), Output1 (out), Output2 (out), Input1 (in)

### Ports
B1_IN (in), B1_OUT (out), B2_IN (in), B2_OUT (out), B3_IN (in), B3_OUT (out), B4_IN (in), B4_OUT (out), B5_IN (in), B5_OUT (out), B6_IN (in), B6_OUT (out), P1_IN (in), P1_OUT (out), P2_IN (in), P2_OUT (out)

### Nets
+5: U5#1.8(V+)  [project net 5V]
GND: C14#1.2 C15#1.2 U5#1.4(V-)
B1_Conditioned: port B1_OUT, sheet U_ButtonBuffering/Output1
B1_Harness: port B1_IN, sheet U_ButtonBuffering/Input1
B2_Conditioned: port B2_OUT, sheet U_ButtonBuffering/Output2
B2_Harness: port B2_IN, sheet U_ButtonBuffering/Input2
B3_Conditioned: port B3_OUT, sheet U_ButtonBuffering/Output1
B3_Harness: port B3_IN, sheet U_ButtonBuffering/Input1
B4_Conditioned: port B4_OUT, sheet U_ButtonBuffering/Output2
B4_Harness: port B4_IN, sheet U_ButtonBuffering/Input2
B5_Conditioned: port B5_OUT, sheet U_ButtonBuffering/Output1
B5_Harness: port B5_IN, sheet U_ButtonBuffering/Input1
B6_Conditioned: port B6_OUT, sheet U_ButtonBuffering/Output2
B6_Harness: port B6_IN, sheet U_ButtonBuffering/Input2
P1_Conditioned: U5#1.1(OUT_A) U5#1.2(-IN_A) ; port P1_OUT
P1_Harness: C14#1.1 U5#1.3(+IN_A) ; port P1_IN
P2_Conditioned: U5#1.6(-IN_B) U5#1.7(OUT_B) ; port P2_OUT
P2_Harness: C15#1.1 U5#1.5(+IN_B) ; port P2_IN

### Library data of the parts
C14#1 C15#1 = 1: as C3#1 on sheet CAN_5V; name: 0603 Capacitor; ESR: 1; package: 0603; quantity: 0
U5#1 = 2: Rail-to-Rail 2 Circuit OPAMP 8SOIC; id: 2; voltage: 6; slewrate: 0.600000023841858; gbw: 0; currentoutput: 23; voltagelow: 1.79999995231628; Name: MCP6002T-I; num_circuits: 2; voltagehigh: 6; quantity: 0; link: https://www.digikey.com/product-detail/en/microchip-technology/MCP6002T-I-SN/MCP6002T-I-SNCT-ND/4307905; createdby: Kevin

## Sheet ButtonBuffering.SchDoc
size A
Used 3 times, as channels U_WheelInputConditioning/U_ButtonBuffering, U_WheelInputConditioning/U_ButtonBuffering, U_WheelInputConditioning/U_ButtonBuffering. Parts and nets are listed once, with the designators drawn on the sheet.
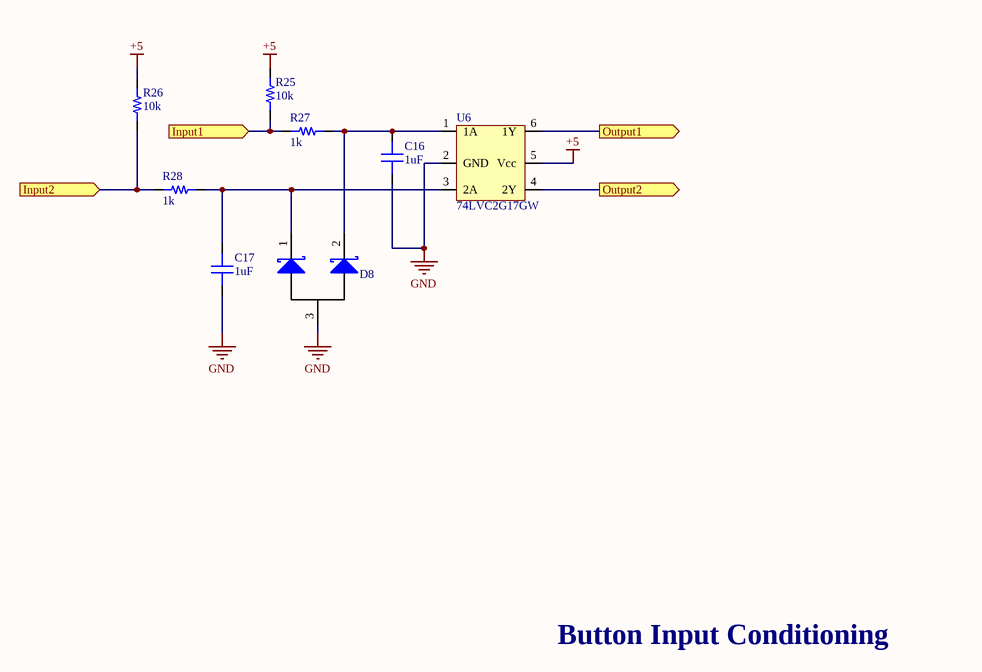
[diagram p10: ButtonBuffering.SchDoc]

### Parts
C16  capacitance: 1uF  [0603]  (hidden comment: capacitor)
C17  capacitance: 1uF  [0603]  (hidden comment: capacitor)
D8  AZ23C4V7-7-F Dual Zenner Diodes  [SOT23-3]  (value not drawn)
R25  10k  [RES 0603/1608]
R26  10k  [RES 0603/1608]
R27  1k  [RES 0603/1608]
R28  1k  [RES 0603/1608]
U6  74LVC2G17GW  [TSOP95P280X110-6N]

### Ports
Input1 (in), Input2 (in), Output1 (out), Output2 (out)

### Nets
+5: R25.2 R26.2 U6.5(Vcc)
GND: C16.1 C17.1 D8.3 U6.2(GND)
Input1: R25.1 R27.1 ; port Input1
Input2: R26.1 R28.1 ; port Input2
Output1: U6.6(1Y) ; port Output1
Output2: U6.4(2Y) ; port Output2
NetC16_2: C16.2 D8.2 R27.2 U6.1(1A)
NetC17_2: C17.2 D8.1 R28.2 U6.3(2A)

### Channels
U_WheelInputConditioning/U_ButtonBuffering: designators C16=C10#2 C17=C9#2 D8=D8 R25=R25 R26=R26 R27=R28 R28=R27 U6=U7#1; ports Input1=B3_Harness Input2=B4_Harness Output1=B3_Conditioned Output2=B4_Conditioned
U_WheelInputConditioning/U_ButtonBuffering: designators C16=C15#2 C17=C14#2 D8=D7#2 R25=R32 R26=R31 R27=R38 R28=R37 U6=U6; ports Input1=B1_Harness Input2=B2_Harness Output1=B1_Conditioned Output2=B2_Conditioned
U_WheelInputConditioning/U_ButtonBuffering: designators C16=C13#2 C17=C12#2 D8=D6#2 R25=R30 R26=R29 R27=R36 R28=R35 U6=U5#2; ports Input1=B5_Harness Input2=B6_Harness Output1=B5_Conditioned Output2=B6_Conditioned

### Notes on the sheet
- Button Input Conditioning

### Library data of the parts
C16 C17 = 1: as C3#1 on sheet CAN_5V; name: 0603 Capacitor; ESR: 1; package: 0603; quantity: 0
D8 = 14: DIODE ZENER ARRAY 4.7V SOT23-3; id: 14; name: AZ23C4V7-7-F; package: SOT23-3; quantity: 0; link: https://www.digikey.com/product-detail/en/diodes-incorporated/AZ23C4V7-7-F/AZ23C4V7-FDICT-ND/815309
R25 R26 = 1: as R9 on sheet CAN_5V; resistance: 10k; package: 0603; quantity: 0
R27 R28 = 1: id: 1; resistance: 1k
U6 = 17: Buffer, Non-Inverting 2 Element 1 Bit per Element Push-Pull Output 6-TSSOP; id: 17; vcc: 5; updatedby: Nolan; name: 74LVC2G17; type: buffer; package: SOT457; quantity: 0; createdby: Nolan; createddate: 10/16/2019 10:08:58 PM; updateddate: 10/16/2019 10:08:58 PM

## Sheet 26PinSuperseal.SchDoc
size A
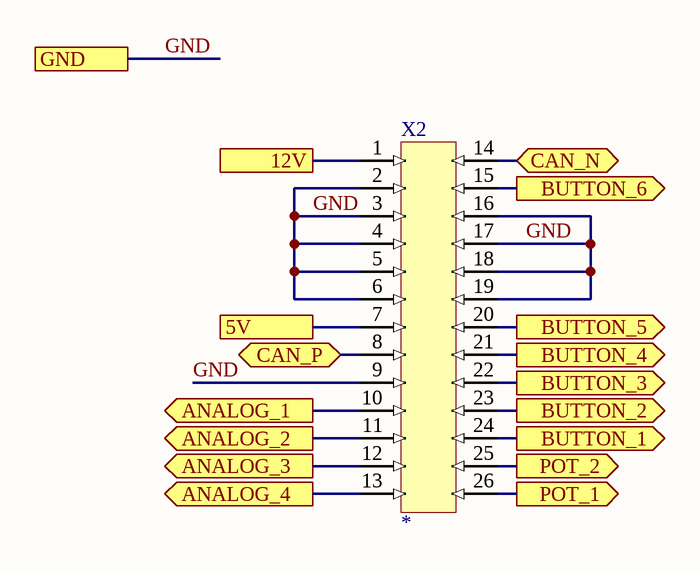
[diagram p11: 26PinSuperseal.SchDoc]

### Parts
X2  *  [TE_Amp_6437288-6]

### Ports
5V, 12V, ANALOG_1 (out), ANALOG_2 (out), ANALOG_3 (out), ANALOG_4 (out), BUTTON_1 (out), BUTTON_2 (out), BUTTON_3 (out), BUTTON_4 (out), BUTTON_5 (out), BUTTON_6 (out), CAN_N (bidir), CAN_P (bidir), GND, POT_1 (out), POT_2 (out)

### Nets
5V: X2.7 ; port 5V
GND: X2.2 X2.3 X2.4 X2.5 X2.6 X2.9 X2.16 X2.17 X2.18 X2.19 ; port GND
12V_HARNESS: X2.1 ; port 12V
A1_Harness: X2.10 ; port ANALOG_1
A2_Harness: X2.11 ; port ANALOG_2
A3_Harness: X2.12 ; port ANALOG_3
A4_Harness: X2.13 ; port ANALOG_4
B1_Harness: X2.24 ; port BUTTON_1
B2_Harness: X2.23 ; port BUTTON_2
B3_Harness: X2.22 ; port BUTTON_3
B4_Harness: X2.21 ; port BUTTON_4
B5_Harness: X2.20 ; port BUTTON_5
B6_Harness: X2.15 ; port BUTTON_6
CAN_N: X2.14 ; port CAN_N
CAN_P: X2.8 ; port CAN_P
P1_Harness: X2.26 ; port POT_1
P2_Harness: X2.25 ; port POT_2

### Library data of the parts
X2 = 7: AMP SuperSeal Straight; id: 7; name: 6437288-6; numcontacts: 26; numrows: 4; pitch: 3mm; MfrPartNo: *; quantity: 0; link: https://www.digikey.com/product-detail/en/te-connectivity-amp-connectors/6437288-6/A123256-ND/2329274

## Sheet 12V_to_5V_LDO_1A.SchDoc
size A; DocumentNumber: 3; SheetNumber: 3; SheetTotal: 12
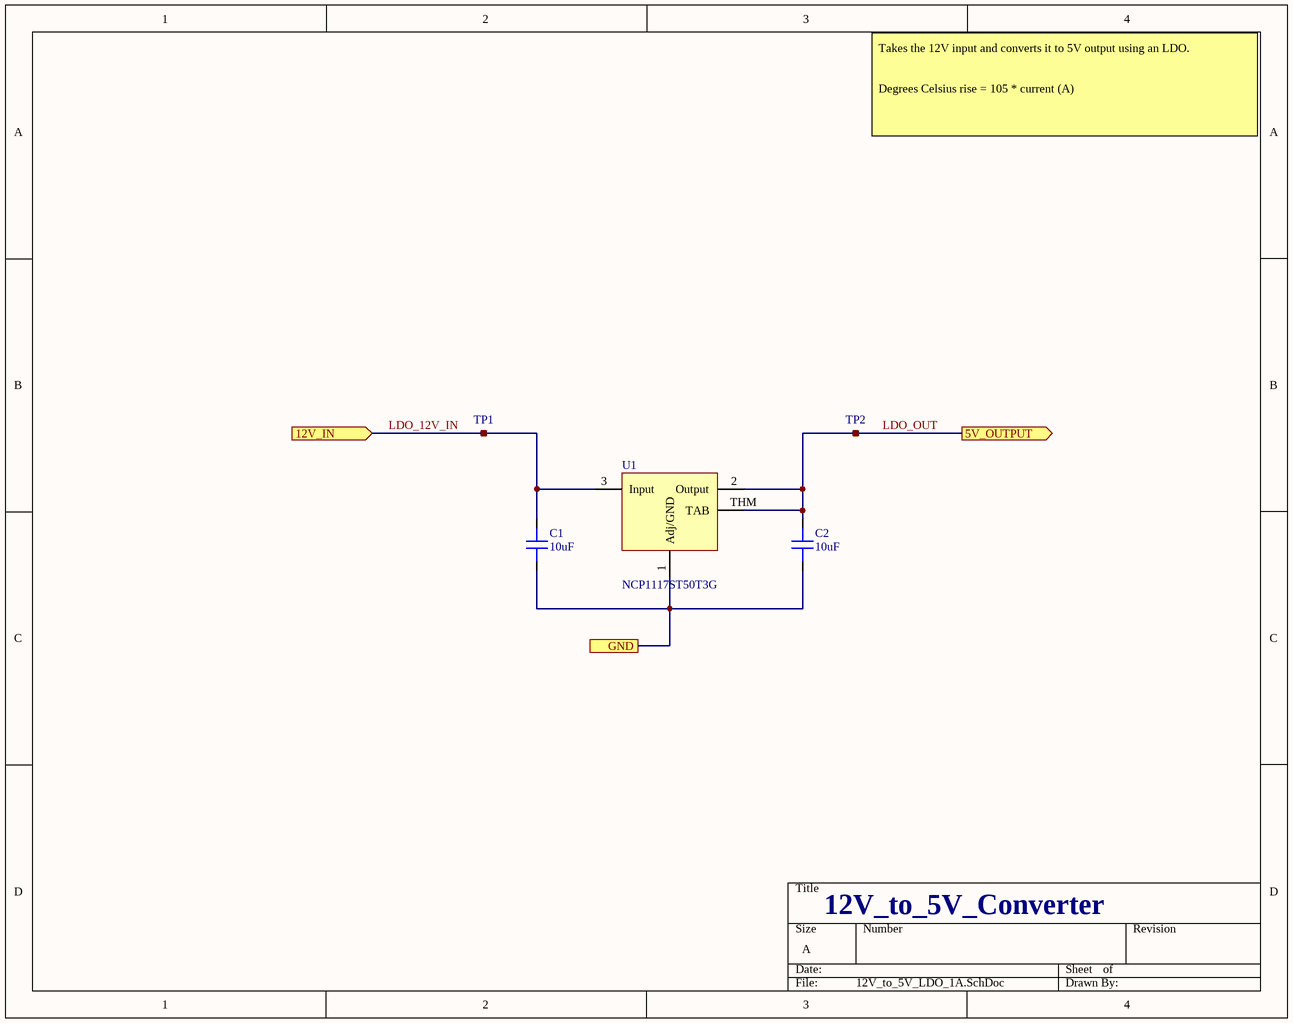
[diagram p12: 12V_to_5V_LDO_1A.SchDoc]

### Parts
(Parts that share a designator on the sheet are numbered #1, #2 ... from top to bottom, then left to right.)
C1#1  capacitance: 10uF  [0603]  (hidden comment: capacitor)
C2#1  capacitance: 10uF  [0603]  (hidden comment: capacitor)
TP1  RCU-0C  [RCU-0C]  (value not drawn)
TP2  RCU-0C  [RCU-0C]  (value not drawn)
U1  NCP1117ST50T3G  [SOT-223-3]

### Ports
5V_OUTPUT (out), 12V_IN (in), GND

### Nets
GND: C1#1.1 C2#1.1 U1.1(Adj/GND) ; port GND
LDO_12V_IN: C1#1.2 TP1.1 U1.3(Input) ; port 12V_IN  [project net 12V]
LDO_OUT: C2#1.2 TP2.1 U1.2(Output) U1.THM(TAB) ; port 5V_OUTPUT  [project net 5V]

### Notes on the sheet
- Takes the 12V input and converts it to 5V output using an LDO.
  Degrees Celsius rise = 105 * current (A)
- 12V_to_5V_Converter

### Library data of the parts
C1#1 C2#1 = 1: as C3#1 on sheet CAN_5V; name: 0603 Capacitor; ESR: 1; package: 0603; quantity: 0
TP1 TP2 = 14: id: 14; numcontacts: 1; name: RCU-0C; numrows: 1; quantity: 0; link: https://www.digikey.com/product-detail/en/te-connectivity-amp-connectors/RCU-0C/A106145CT-ND/3477802
U1 = 16: 5V linear regulator; id: 16; imax: 1; name: NCP1117ST50T3G; package: SOT-223-3; quantity: 0; link: https://www.digikey.com/product-detail/en/on-semiconductor/NCP1117ST50T3G/NCP1117ST50T3GOSCT-ND/1967217

## Sheet AnalogInputFiltering.SchDoc
size A
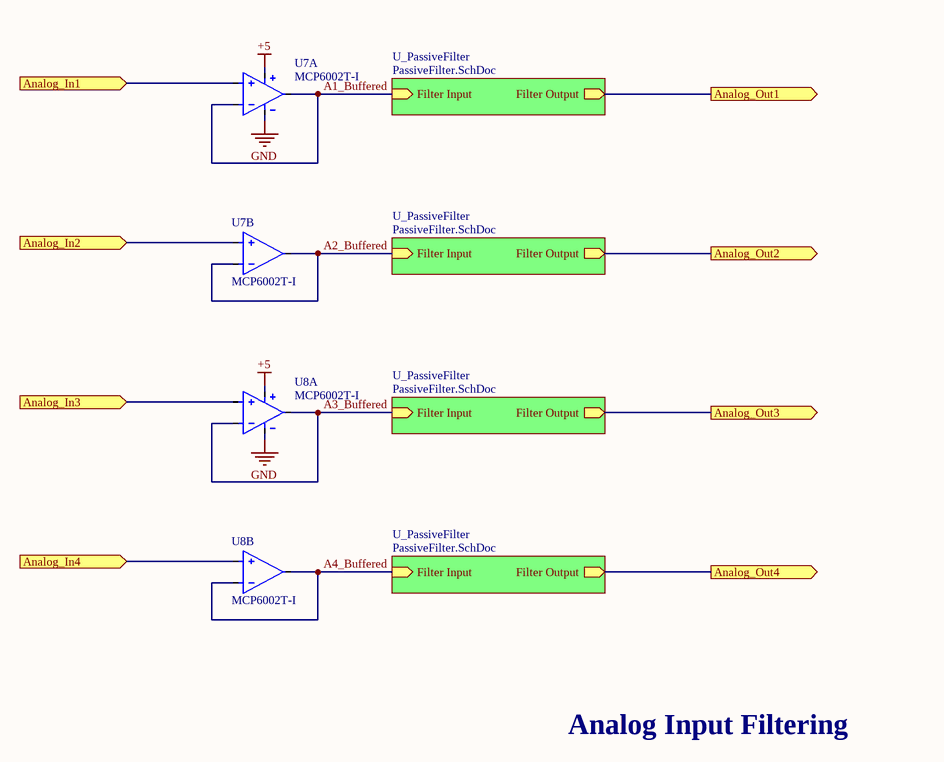
[diagram p13: AnalogInputFiltering.SchDoc]

### Parts
(Parts that share a designator on the sheet are numbered #1, #2 ... from top to bottom, then left to right.)
U7#2  MCP6002T-I  [SOIC-8]  (parts A,B of 2)
U8  MCP6002T-I  [SOIC-8]  (parts A,B of 2)

### Sub-sheets
U_PassiveFilter = PassiveFilter.SchDoc: Filter Input (in), Filter Output (out)
U_PassiveFilter = PassiveFilter.SchDoc: Filter Input (in), Filter Output (out)
U_PassiveFilter = PassiveFilter.SchDoc: Filter Input (in), Filter Output (out)
U_PassiveFilter = PassiveFilter.SchDoc: Filter Input (in), Filter Output (out)

### Ports
Analog_In1 (in), Analog_In2 (in), Analog_In3 (in), Analog_In4 (in), Analog_Out1 (out), Analog_Out2 (out), Analog_Out3 (out), Analog_Out4 (out)

### Nets
+5: U7#2.8(V+) U8.8(V+)  [project net 5V]
GND: U7#2.4(V-) U8.4(V-)
A1_Buffered: U7#2.1(OUT_A) U7#2.2(-IN_A) ; sheet U_PassiveFilter/Filter Input
A1_Filtered: port Analog_Out1, sheet U_PassiveFilter/Filter Output
A1_Harness: U7#2.3(+IN_A) ; port Analog_In1
A2_Buffered: U7#2.6(-IN_B) U7#2.7(OUT_B) ; sheet U_PassiveFilter/Filter Input
A2_Filtered: port Analog_Out2, sheet U_PassiveFilter/Filter Output
A2_Harness: U7#2.5(+IN_B) ; port Analog_In2
A3_Buffered: U8.1(OUT_A) U8.2(-IN_A) ; sheet U_PassiveFilter/Filter Input
A3_Filtered: port Analog_Out3, sheet U_PassiveFilter/Filter Output
A3_Harness: U8.3(+IN_A) ; port Analog_In3
A4_Buffered: U8.6(-IN_B) U8.7(OUT_B) ; sheet U_PassiveFilter/Filter Input
A4_Filtered: port Analog_Out4, sheet U_PassiveFilter/Filter Output
A4_Harness: U8.5(+IN_B) ; port Analog_In4

### Notes on the sheet
- Analog Input Filtering

### Library data of the parts
U7#2 U8 = 2: as U5#1 on sheet WheelInputConditioning; Name: MCP6002T-I; num_circuits: 2; voltagehigh: 6; quantity: 0; link: https://www.digikey.com/product-detail/en/microchip-technology/MCP6002T-I-SN/MCP6002T-I-SNCT-ND/4307905; createdby: Kevin

## Sheet PassiveFilter.SchDoc
size A
Used 4 times, as channels U_AnalogInputFiltering/U_PassiveFilter, U_AnalogInputFiltering/U_PassiveFilter, U_AnalogInputFiltering/U_PassiveFilter, U_AnalogInputFiltering/U_PassiveFilter. Parts and nets are listed once, with the designators drawn on the sheet.
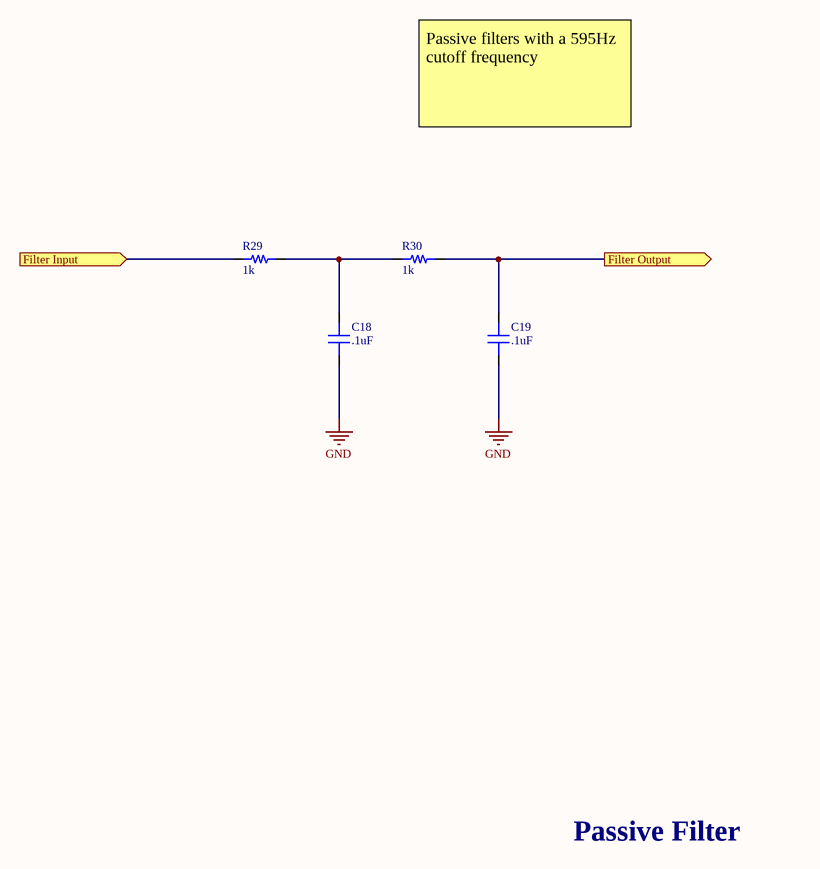
[diagram p14: PassiveFilter.SchDoc]

### Parts
C18  capacitance: .1uF  [0603]  (hidden comment: capacitor)
C19  capacitance: .1uF  [0603]  (hidden comment: capacitor)
R29  1k  [RES 0603/1608]
R30  1k  [RES 0603/1608]

### Ports
Filter Input (in), Filter Output (out)

### Nets
GND: C18.1 C19.1
Filter Input: R29.1 ; port Filter Input
Filter Output: C19.2 R30.2 ; port Filter Output
NetC18_2: C18.2 R29.2 R30.1

### Channels
U_AnalogInputFiltering/U_PassiveFilter: designators C18=C4#2 C19=C7#2 R29=R3#2 R30=R6#2; ports Filter Input=A1_Buffered Filter Output=A1_Filtered
U_AnalogInputFiltering/U_PassiveFilter: designators C18=C1#2 C19=C8#2 R29=R7#2 R30=R8#2; ports Filter Input=A2_Buffered Filter Output=A2_Filtered
U_AnalogInputFiltering/U_PassiveFilter: designators C18=C3#2 C19=C6#2 R29=R2#2 R30=R5#2; ports Filter Input=A3_Buffered Filter Output=A3_Filtered
U_AnalogInputFiltering/U_PassiveFilter: designators C18=C2#2 C19=C5#2 R29=R1#2 R30=R4#2; ports Filter Input=A4_Buffered Filter Output=A4_Filtered

### Notes on the sheet
- Passive filters with a 595Hz cutoff frequency
- Passive Filter

### Library data of the parts
C18 C19 = 1: as C3#1 on sheet CAN_5V; name: 0603 Capacitor; ESR: 1; package: 0603; quantity: 0
R29 R30 = 1: as R9 on sheet CAN_5V; resistance: 1k; package: 0603; quantity: 0

## Nets that join several sheets
5V: CAN_5V (C3#1.2 U2.3), MKE1xFxxxVLH (12 pins), FTDI_USB_UART (7 pins), LCD (LCD1.2 LCD1.19), WheelInputConditioning (U5#1.8), U_WheelInputConditioning/U_ButtonBuffering (R25.2 R26.2 U7#1.5), U_WheelInputConditioning/U_ButtonBuffering (R31.2 R32.2 U6.5), U_WheelInputConditioning/U_ButtonBuffering (R29.2 R30.2 U5#2.5), 26PinSuperseal (X2.7), 12V_to_5V_LDO_1A (C2#1.2 TP2.1 U1.2 U1.THM), AnalogInputFiltering (U7#2.8 U8.8)
12V: 7_SEGMENT (DS1.1 DS1.5), RVPOVP (D3.2 Q1.2), WARNING_LEDS (D4.1 D5.1 D6#1.1 D7#1.1), 12V_to_5V_LDO_1A (C1#1.2 TP1.1 U1.3)
GND: CAN_5V (C3#1.1 C4#1.2 R11.1 U2.2), U_7_SEGMENT/U_LED_Driver (M7.2 R43.1), U_7_SEGMENT/U_LED_Driver (M6.2 R42.1), U_7_SEGMENT/U_LED_Driver (M5.2 R41.1), U_7_SEGMENT/U_LED_Driver (M8.2 R44.1), U_7_SEGMENT/U_LED_Driver (M11.2 R47.1), U_7_SEGMENT/U_LED_Driver (M10.2 R46.1), U_7_SEGMENT/U_LED_Driver (M9.2 R45.1), U_7_SEGMENT/U_LED_Driver (M12.2 R48.1), RVPOVP (C13#1.1 R20.1), U_WARNING_LEDS/U_LED_Driver (M3.2 R16#1.1), U_WARNING_LEDS/U_LED_Driver (M4.2 R15#1.1), U_WARNING_LEDS/U_LED_Driver (M1.2 R13#1.1), U_WARNING_LEDS/U_LED_Driver (M2.2 R14#1.1), MKE1xFxxxVLH (9 pins), FTDI_USB_UART (11 pins), LCD (LCD1.1), U_LCD/U_LED_Driver (M13.2 R50.1), WheelInputConditioning (C14#1.2 C15#1.2 U5#1.4), U_WheelInputConditioning/U_ButtonBuffering (C9#2.1 C10#2.1 D8.3 U7#1.2), U_WheelInputConditioning/U_ButtonBuffering (C14#2.1 C15#2.1 D7#2.3 U6.2), U_WheelInputConditioning/U_ButtonBuffering (C12#2.1 C13#2.1 D6#2.3 U5#2.2), 26PinSuperseal (10 pins), 12V_to_5V_LDO_1A (C1#1.1 C2#1.1 U1.1), AnalogInputFiltering (U7#2.4 U8.4), U_AnalogInputFiltering/U_PassiveFilter (C4#2.1 C7#2.1), U_AnalogInputFiltering/U_PassiveFilter (C1#2.1 C8#2.1), U_AnalogInputFiltering/U_PassiveFilter (C3#2.1 C6#2.1), U_AnalogInputFiltering/U_PassiveFilter (C2#2.1 C5#2.1)
7SEG_a_SIG: U_7_SEGMENT/U_LED_Driver (M8.1 R44.2), MKE1xFxxxVLH (U4.37)
7SEG_b_SIG: U_7_SEGMENT/U_LED_Driver (M11.1 R47.2), MKE1xFxxxVLH (U4.36)
7SEG_c_SIG: U_7_SEGMENT/U_LED_Driver (M12.1 R48.2), MKE1xFxxxVLH (U4.45)
7SEG_d_SIG: U_7_SEGMENT/U_LED_Driver (M9.1 R45.2), MKE1xFxxxVLH (U4.44)
7SEG_DP_SIG: U_7_SEGMENT/U_LED_Driver (M5.1 R41.2), MKE1xFxxxVLH (U4.27)
7SEG_e_SIG: U_7_SEGMENT/U_LED_Driver (M10.1 R46.2), MKE1xFxxxVLH (U4.35)
7SEG_f_SIG: U_7_SEGMENT/U_LED_Driver (M6.1 R42.2), MKE1xFxxxVLH (U4.26)
7SEG_g_SIG: U_7_SEGMENT/U_LED_Driver (M7.1 R43.2), MKE1xFxxxVLH (U4.25)
12V_HARNESS: RVPOVP (C13#1.2 Q1.3), 26PinSuperseal (X2.1)
A1_Buffered: AnalogInputFiltering (U7#2.1 U7#2.2), U_AnalogInputFiltering/U_PassiveFilter (R3#2.1)
A1_Filtered: MKE1xFxxxVLH (U4.49), U_AnalogInputFiltering/U_PassiveFilter (C7#2.2 R6#2.2)
A1_Harness: 26PinSuperseal (X2.10), AnalogInputFiltering (U7#2.3)
A2_Buffered: AnalogInputFiltering (U7#2.6 U7#2.7), U_AnalogInputFiltering/U_PassiveFilter (R7#2.1)
A2_Filtered: MKE1xFxxxVLH (U4.51), U_AnalogInputFiltering/U_PassiveFilter (C8#2.2 R8#2.2)
A2_Harness: 26PinSuperseal (X2.11), AnalogInputFiltering (U7#2.5)
A3_Buffered: AnalogInputFiltering (U8.1 U8.2), U_AnalogInputFiltering/U_PassiveFilter (R2#2.1)
A3_Filtered: MKE1xFxxxVLH (U4.53), U_AnalogInputFiltering/U_PassiveFilter (C6#2.2 R5#2.2)
A3_Harness: 26PinSuperseal (X2.12), AnalogInputFiltering (U8.3)
A4_Buffered: AnalogInputFiltering (U8.6 U8.7), U_AnalogInputFiltering/U_PassiveFilter (R1#2.1)
A4_Filtered: MKE1xFxxxVLH (U4.55), U_AnalogInputFiltering/U_PassiveFilter (C5#2.2 R4#2.2)
A4_Harness: 26PinSuperseal (X2.13), AnalogInputFiltering (U8.5)
B1_Conditioned: MKE1xFxxxVLH (U4.13), U_WheelInputConditioning/U_ButtonBuffering (U6.6)
B1_Harness: U_WheelInputConditioning/U_ButtonBuffering (R32.1 R38.1), 26PinSuperseal (X2.24)
B2_Conditioned: MKE1xFxxxVLH (U4.14), U_WheelInputConditioning/U_ButtonBuffering (U6.4)
B2_Harness: U_WheelInputConditioning/U_ButtonBuffering (R31.1 R37.1), 26PinSuperseal (X2.23)
B3_Conditioned: MKE1xFxxxVLH (U4.15), U_WheelInputConditioning/U_ButtonBuffering (U7#1.6)
B3_Harness: U_WheelInputConditioning/U_ButtonBuffering (R25.1 R28.1), 26PinSuperseal (X2.22)
B4_Conditioned: MKE1xFxxxVLH (U4.16), U_WheelInputConditioning/U_ButtonBuffering (U7#1.4)
B4_Harness: U_WheelInputConditioning/U_ButtonBuffering (R26.1 R27.1), 26PinSuperseal (X2.21)
B5_Conditioned: MKE1xFxxxVLH (U4.17), U_WheelInputConditioning/U_ButtonBuffering (U5#2.6)
B5_Harness: U_WheelInputConditioning/U_ButtonBuffering (R30.1 R36.1), 26PinSuperseal (X2.20)
B6_Conditioned: MKE1xFxxxVLH (U4.18), U_WheelInputConditioning/U_ButtonBuffering (U5#2.4)
B6_Harness: U_WheelInputConditioning/U_ButtonBuffering (R29.1 R35.1), 26PinSuperseal (X2.15)
CAN_N: CAN_5V (R9.2 U2.6), 26PinSuperseal (X2.14)
CAN_P: CAN_5V (R10.1 U2.7), 26PinSuperseal (X2.8)
JTAG_RST: MKE1xFxxxVLH (R19.1 U4.63 X1.10), FTDI_USB_UART (C6#1.1)
LCD_BL: MKE1xFxxxVLH (U4.46), U_LCD/U_LED_Driver (M13.1 R50.2)
LCD_RESET: MKE1xFxxxVLH (U4.34), LCD (LCD1.17)
LCD_SPI_CLK: MKE1xFxxxVLH (U4.32), LCD (LCD1.6)
LCD_SPI_CS: MKE1xFxxxVLH (U4.31), LCD (LCD1.4)
LCD_SPI_SDA: MKE1xFxxxVLH (U4.33), LCD (LCD1.5)
LED1: U_WARNING_LEDS/U_LED_Driver (M3.1 R16#1.2), MKE1xFxxxVLH (U4.1)
LED2: U_WARNING_LEDS/U_LED_Driver (M4.1 R15#1.2), MKE1xFxxxVLH (U4.2)
LED3: U_WARNING_LEDS/U_LED_Driver (M1.1 R13#1.2), MKE1xFxxxVLH (U4.3)
LED4: U_WARNING_LEDS/U_LED_Driver (M2.1 R14#1.2), MKE1xFxxxVLH (U4.4)
LED_Negative: 7_SEGMENT (R1#1.2), U_7_SEGMENT/U_LED_Driver (M7.3)
LED_Negative: 7_SEGMENT (R5#1.2), U_7_SEGMENT/U_LED_Driver (M5.3)
LED_Negative: 7_SEGMENT (R3#1.2), U_7_SEGMENT/U_LED_Driver (M6.3)
LED_Negative: 7_SEGMENT (R6#1.2), U_7_SEGMENT/U_LED_Driver (M8.3)
LED_Negative: 7_SEGMENT (R8#1.2), U_7_SEGMENT/U_LED_Driver (M11.3)
LED_Negative: 7_SEGMENT (R7#1.1), U_7_SEGMENT/U_LED_Driver (M12.3)
LED_Negative: 7_SEGMENT (R4#1.1), U_7_SEGMENT/U_LED_Driver (M9.3)
LED_Negative: 7_SEGMENT (R2#1.1), U_7_SEGMENT/U_LED_Driver (M10.3)
LED_Negative: WARNING_LEDS (R21.2), U_WARNING_LEDS/U_LED_Driver (M3.3)
LED_Negative: WARNING_LEDS (R23.2), U_WARNING_LEDS/U_LED_Driver (M1.3)
LED_Negative: WARNING_LEDS (R24.2), U_WARNING_LEDS/U_LED_Driver (M2.3)
LED_Negative: WARNING_LEDS (R22.2), U_WARNING_LEDS/U_LED_Driver (M4.3)
LED_Negative: LCD (LCD1.20), U_LCD/U_LED_Driver (M13.3)
P1_Conditioned: MKE1xFxxxVLH (U4.29), WheelInputConditioning (U5#1.1 U5#1.2)
P1_Harness: WheelInputConditioning (C14#1.1 U5#1.3), 26PinSuperseal (X2.26)
P2_Conditioned: MKE1xFxxxVLH (U4.28), WheelInputConditioning (U5#1.6 U5#1.7)
P2_Harness: WheelInputConditioning (C15#1.1 U5#1.5), 26PinSuperseal (X2.25)
RXCAN: CAN_5V (U2.4), MKE1xFxxxVLH (U4.21)
TXCAN: CAN_5V (U2.1), MKE1xFxxxVLH (U4.20)
USB_UART_RX: MKE1xFxxxVLH (U4.48), FTDI_USB_UART (R12.2)
USB_UART_TX: MKE1xFxxxVLH (U4.47), FTDI_USB_UART (R13#2.2)